# EAGLE design uo_C_SE_Display_Module (EAGLE 9.0.1)
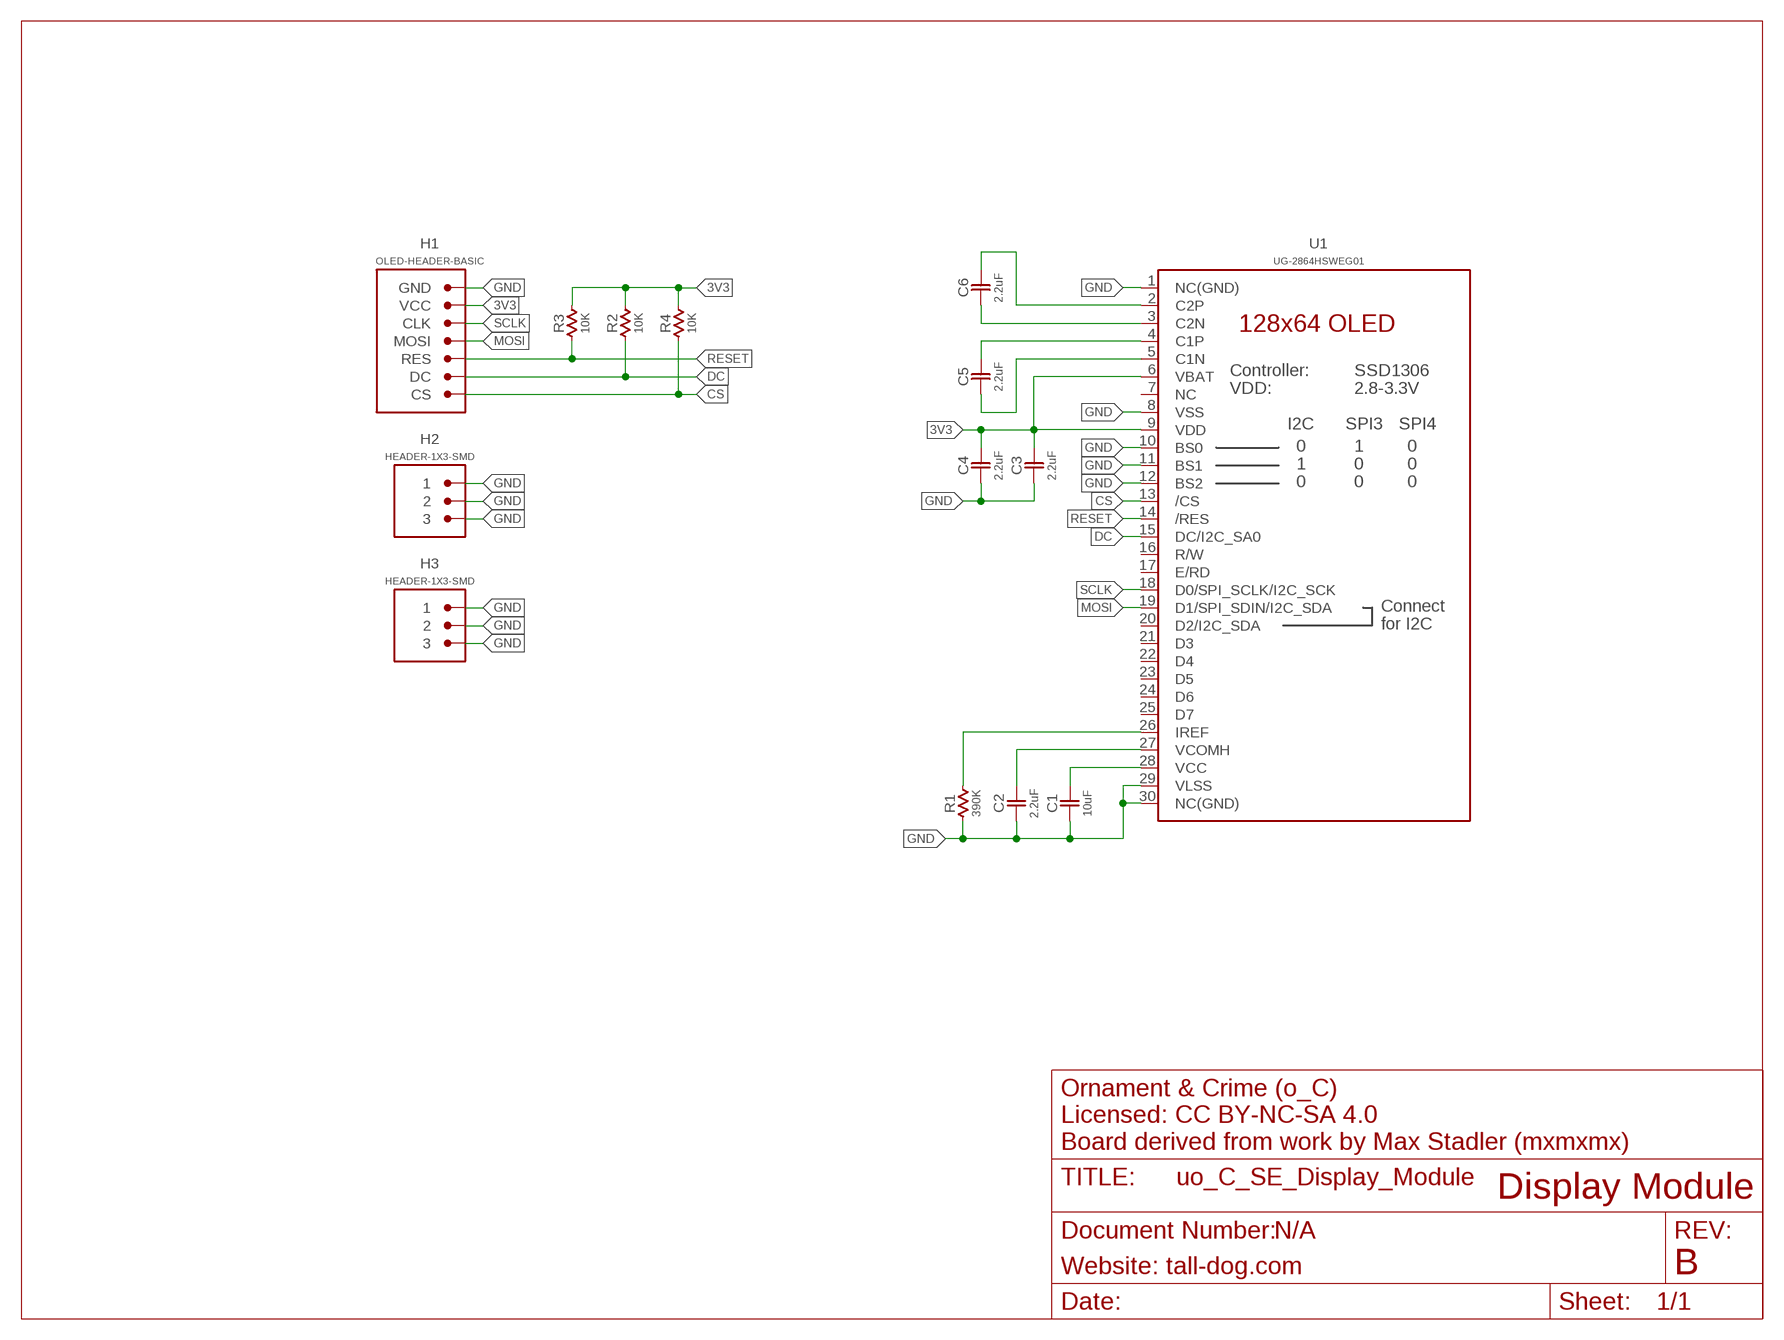
[diagram p0: schematic, sheet 1]

## Parts
C1  10uF  CAP-NP-0805  [0805-NP]
C2  2.2uF  CAP-NP-0805  [0805-NP]
C3  2.2uF  CAP-NP-0805  [0805-NP]
C4  2.2uF  CAP-NP-0805  [0805-NP]
C5  2.2uF  CAP-NP-0805  [0805-NP]
C6  2.2uF  CAP-NP-0805  [0805-NP]
H1  OLED-HEADER-BASIC  [SMD-0.1-1X7]
H2  HEADER-1X3-SMD  [SMD-0.1-1X3]
H3  HEADER-1X3-SMD  [SMD-0.1-1X3]
R1  390K  RESISTOR-0805  [0805-NP]
R2  10K  RESISTOR-0805  [0805-NP]
R3  10K  RESISTOR-0805  [0805-NP]
R4  10K  RESISTOR-0805  [0805-NP]
U1  UG-2864HSWEG01  OLED-128X64  [OLED-128X64]

## Nets
3V3: C3.2 C4.2 H1.2(VCC) R2.2 R3.2 R4.2 U1.6(VBAT) U1.9(VDD)
CS: H1.7(CS) R4.1 U1.13(/CS)
DC: H1.6(DC) R2.1 U1.15(DC/I2C_SA0)
GND: C1.1 C2.1 C3.1 C4.1 H1.1(GND) H2.1 H2.2 H2.3 H3.1 H3.2 H3.3 R1.1 U1.1(NC(GND)) U1.8(VSS) U1.10(BS0) U1.11(BS1) U1.12(BS2) U1.29(VLSS) U1.30(NC(GND))
MOSI: H1.4(MOSI) U1.19(D1/SPI_SDIN/I2C_SDA)
N$3: R1.2 U1.26(IREF)
N$4: C6.2 U1.2(C2P)
N$5: C6.1 U1.3(C2N)
N$6: C5.2 U1.4(C1P)
N$7: C5.1 U1.5(C1N)
N$11: C1.2 U1.28(VCC)
N$12: C2.2 U1.27(VCOMH)
RESET: H1.5(RES) R3.1 U1.14(/RES)
SCLK: H1.3(CLK) U1.18(D0/SPI_SCLK/I2C_SCK)
Unconnected: U1.7(NC) U1.16(R/W) U1.17(E/RD) U1.20(D2/I2C_SDA) U1.21(D3) U1.22(D4) U1.23(D5) U1.24(D6) U1.25(D7)

## Notes on the sheet
- Ornament & Crime (o_C)
  Licensed: CC BY-NC-SA 4.0
  Board derived from work by Max Stadler (mxmxmx)
- Display Module
- N/A
- Website: tall-dog.com | B

## Library data of the parts
C1-C6 = uo_C_SE_Library:CAP-NP
H1 = uo_C_SE_Library:OLED-HEADER
H2 H3 = uo_C_SE_Library:HEADER-1X3
R1-R4 = uo_C_SE_Library:RESISTOR
U1 = uo_C_SE_Library:OLED-128X64: UG-2864HSWEG01 OLED display Both 1.3" and 0.96" models share the same FPC tab footprint, only the screen dimensions vary.

## Board
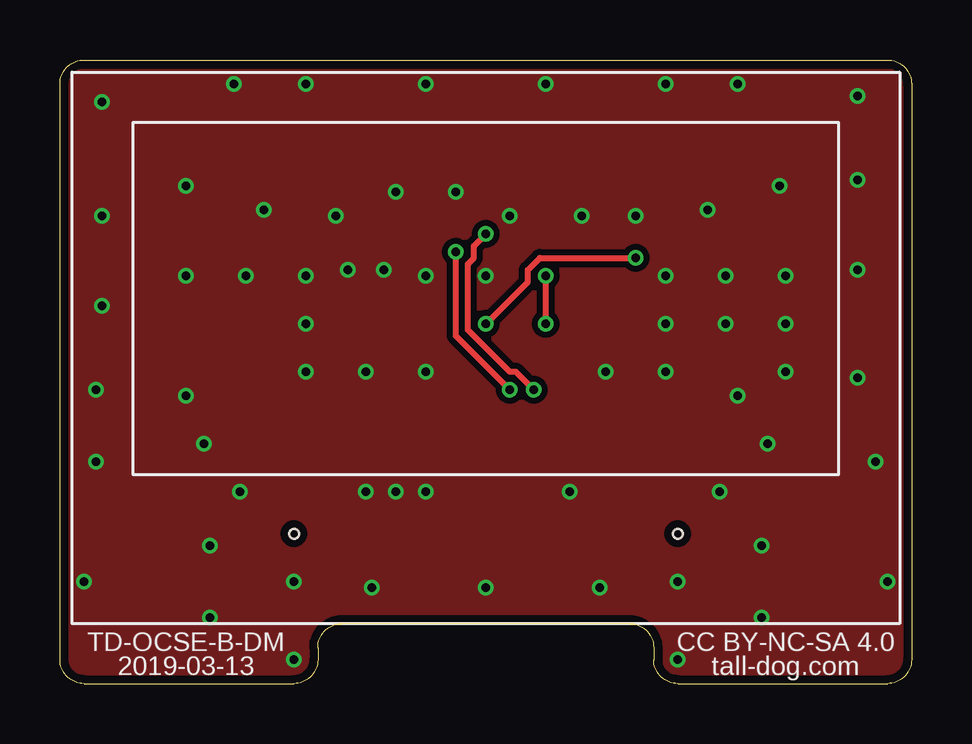
[diagram p1: board, top side]
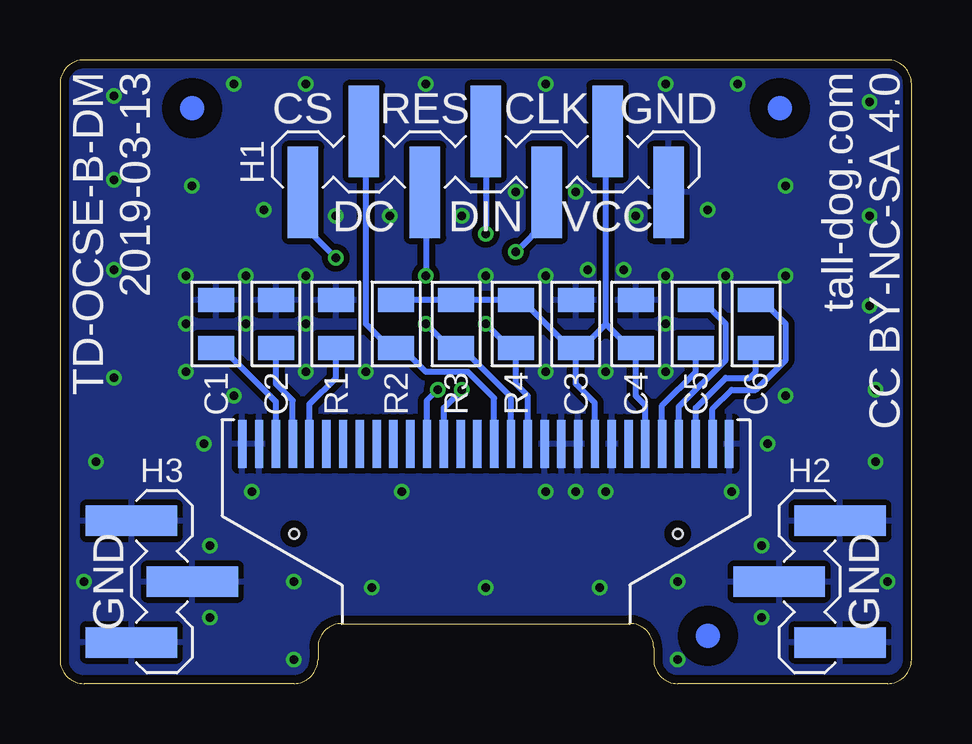
[diagram p2: board, bottom side, seen from below]

Size 35.5 x 26 mm. Coordinates in mm from the lower left corner, seen from the top.
Outline: 1,26 34.5,26 arc-90 35.5,25 35.5,1 arc-90 34.5,0 25.75,0 arc-90 24.75,1 24.75,1.5 arc90 23.75,2.5 11.75,2.5 arc90 10.75,1.5 10.75,1 arc-90 9.75,0 1,0 arc-90 0,1 0,25 arc-90 1,26
Copper layers (1*16): Top 0.035mm / dielectric 1.5mm / Bottom 0.035mm
Design rules "default *": minimum track width 0.25mm, minimum drill 0.25mm, track to track 6mil, track to pad 6mil, pad to pad 6mil, via to via 6mil, smd to smd 0mil, copper to edge 14mil, drill to drill 8mil, minimum pad ring 6mil, minimum via ring 6mil, stop-mask expansion 0mil, vias tented up to drill 0.35mm, thermal gap 10mil

### Footprints (pad centres in the part's own frame; a part is rotated, then mirrored left to right if it is on the bottom)
0805-NP = smd 1 x 1.5: 1 -1,0; 2 1,0
SMD-0.1-1X7 = smd 1.27 x 3.81: 1 -7.62,1.27; 2 -5.08,-1.27; 3 -2.54,1.27; 4 0,-1.27; 5 2.54,1.27; 6 5.08,-1.27; 7 7.62,1.27
SMD-0.1-1X3 = smd 1.27 x 3.81: 1 -2.54,-1.27; 2 0,1.27; 3 2.54,-1.27
OLED-128X64 = smd 0.35 x 2 bottom: 1 -10.15,0; 2 -9.45,0; 3 -8.75,0; 4 -8.05,0; 5 -7.35,0; 6 -6.65,0; 7 -5.95,0; 8 -5.25,0; 9 -4.55,0; 10 -3.85,0; 11 -3.15,0; 12 -2.45,0; 13 -1.75,0; 14 -1.05,0; 15 -0.35,0; 16 0.35,0; 17 1.05,0; 18 1.75,0; 19 2.45,0; 20 3.15,0; 21 3.85,0; 22 4.55,0; 23 5.25,0; 24 5.95,0; 25 6.65,0; 26 7.35,0; 27 8.05,0; 28 8.75,0; 29 9.45,0; 30 10.15,0 | hole 0.4: -8,-3.75; 8,-3.75

### Placement (x,y rotation side)
C1  29,15 270 bottom
C2  26.5,15 270 bottom
C3  14,15 270 bottom
C4  11.5,15 270 bottom
C5  9,15 90 bottom
C6  6.5,15 90 bottom
H1  17.75,21.75 180 bottom
H2  4.25,4.25 90 bottom
H3  31.25,4.25 270 bottom
R1  24,15 270 bottom
R2  21.5,15 90 bottom
R3  19,15 90 bottom
R4  16.5,15 90 bottom
U1  17.75,10 0 top
U$1  [FIDUCIAL]  5.5,24 0 bottom
U$2  [FIDUCIAL]  30,24 0 bottom
U$3  [FIDUCIAL]  8.5,2 0 bottom

### Tracks (layer width: path | path; a pad name or v marks a point on that pad's centre or on a via)
3V3
  Bottom 0.25: 13.2,11.55 U1.9 13.2,11.7 14,12.5 C3.2 | R2.2 R3.2 R4.2 16.25,16 14.25,14 C3.2 | H1.2 12.75,23.02 12.75,15 | U1.6 11.1,11.6 11.5,12 C4.2 11.75,14 12.75,15 | C3.2 13.75,14 12.75,15
CS  (via drill 0.35)
  Top 0.25: v17.75,15 19.5,16.75 19.5,17.25 20,17.75 v24,17.75
  Bottom 0.25: U1.13 16,12 16.5,12.5 R4.1 16.75,14 v17.75,15 | H1.7 25.37,19.12 v24,17.75
DC
  Bottom 0.25: U1.15 17.4,11.9 18.5,13 20.25,13 21.25,14 R2.1 21.75,14 22.75,15 22.75,23.02 H1.6
GND  (via drill 0.35)
  other vias: 15.25,13 22.75,13 10.25,15 10.25,17 25.25,17 27.75,17 30.25,17 30.25,15 27.75,15 25.25,15 6,10 29.5,10 28.25,12 12.75,13 7.5,8 12.75,8 14,8 15.25,8 27.5,8 17.75,17 7.75,17 5.25,17 14,20.5 16.5,20.5 21.75,19.5 24,19.5 20.25,25 25.25,25 15.25,25 10.25,25 8.5,19.75 11.5,19.5 18.75,19.5 27,19.75 30.25,13 5.25,12 21.25,8 34.5,4.25 1,4.25 25.75,4.25 9.75,4.25 1.5,9.25 34,9.25 33.25,24.5 1.75,24.25 17.75,4 25.75,1 9.75,1 15.25,17 10.25,13 25.25,13 12,17.25 13.5,17.25 33.25,17.25 1.75,15.75 7.25,25 28.25,25 1.75,19.5 33.25,21 30,20.75 5.25,20.75 1.5,12.25 33.25,12.75 13,4 22.5,4 6.25,5.75 6.25,2.75 29.25,5.75 29.25,2.75
  pour Bottom (isolate 0.25): 0,26 35.5,26 35.5,0 0,0
  pour Top (isolate 0.25): 0,26 35.5,26 35.5,0 0,0
MOSI  (via drill 0.35)
  Top 0.25: v17.75,18.75 17.25,18.25 17.25,17.75 17,17.5 17,14.75 18.75,13 19,13 v19.75,12.25
  Bottom 0.25: 20.2,11.2 U1.19 20.2,11.8 v19.75,12.25 | H1.4 v17.75,18.75
N$3
  Bottom 0.25: R1.2 24,12.75 25.1,11.65 U1.26
N$4
  Bottom 0.25: U1.2 8.3,11.45 7.5,12.25 6.5,12.25 5.25,13.5 5.25,15 6.25,16 C6.2
N$5
  Bottom 0.25: U1.3 9,11.5 7.75,12.75 6.75,12.75 6.5,13 C6.1
N$6
  Bottom 0.25: U1.4 9.7,11.55 7.75,13.5 7.75,15 8.75,16 C5.2
N$7
  Bottom 0.25: U1.5 10.4,11.6 9,13 C5.1
N$11
  Bottom 0.25: U1.28 26.5,11.75 28.75,14 C1.2
N$12
  Bottom 0.25: U1.27 25.8,11.8 26.5,12.5 C2.2
RESET  (via drill 0.35)
  Top 0.25: v20.25,15 v20.25,17
  Bottom 0.25: U1.14 16.7,11.95 18.75,14 R3.1 19.25,14 v20.25,15 | H1.5 20.29,20.46 20.25,20.46 v20.25,17
SCLK  (via drill 0.35)
  Top 0.25: v18.75,12.25 16.5,14.5 v16.5,18
  Bottom 0.25: U1.18 19.5,11.5 v18.75,12.25 | 15.21,20.54 H1.3 15.21,19.29 v16.5,18

### Text on the board
tPlace: TD-OCSE-B-DM | CC BY-NC-SA 4.0 | 2019-03-13 | tall-dog.com
bPlace: tall-dog.com / CC BY-NC-SA 4.0 | TD-OCSE-B-DM / 2019-03-13 | GND | CLK | RES | CS | VCC | DIN | DC | GND | GND